# Altium project 48FE+2GE+2SFP.PrjPcb (part 9 of 9)
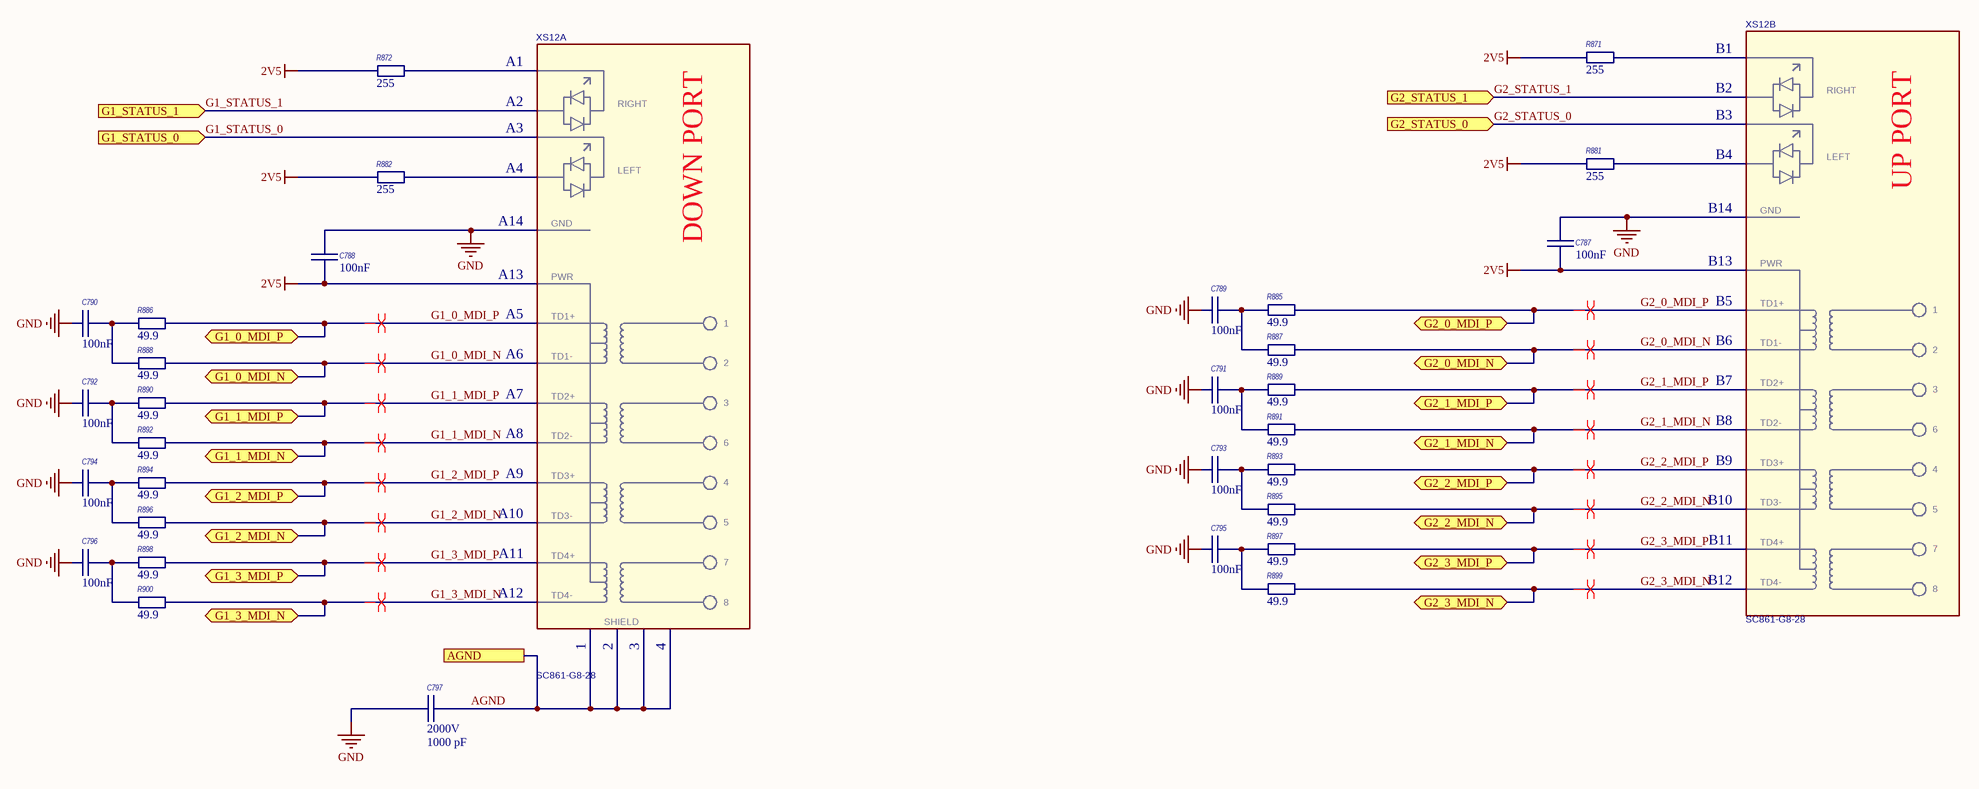
[diagram p26: 44_GE_PORT_1-2.SchDoc]

## Nets that join several sheets
1V: 1_PWR_1 (7 pins), 30_PP0_PWR (59 pins), 40_PP1_PWR (55 pins)
2V5: 11_PHY_FE_17-24 (19 pins), 13_PHY_FE_33-40 (19 pins), 14_PHY_FE_41-48 (19 pins), 15_FE_PORT_1-8 (L34.1), 16_FE_PORT_9-16 (L43.1), 17_FE_PORT_17-24 (L44.1), 22_PHY_GE_PP1 (11 pins), 30_PP0_PWR (14 pins), 33_PP0_CONFIG (5 pins), 40_PP1_PWR (12 pins), 44_GE_PORT_1-2 (8 pins)
3V3: 5_CLOCK GENERATOR (7 pins), 7_PP0_PHY_CPU_88E1116 (TP98.1), 22_PHY_GE_PP1 (XP13.10), 23_SFP_PORTS (21 pins), 27_PP0_GPP, SPI (13 pins), 28_PP0_SGMII, LED, TWSI (R700.1 R701.1), 30_PP0_PWR (20 pins), 32_PP0_NC (R702.1), 33_PP0_CONFIG (6 pins), 34_PP1_JTAG, PCIe (R749.2 R751.2 R753.2 R760.1), 40_PP1_PWR (22 pins), 42_PP1_NC (R831.1)
GND: 1_PWR_1 (25 pins), 5_CLOCK GENERATOR (14 pins), 6_LED INTERFACE SFP (LED1.6 LED1.8), 7_PP0_PHY_CPU_88E1116 (TP97.1), 11_PHY_FE_17-24 (41 pins), 13_PHY_FE_33-40 (40 pins), 14_PHY_FE_41-48 (41 pins), 15_FE_PORT_1-8 (33 pins), 16_FE_PORT_9-16 (33 pins), 17_FE_PORT_17-24 (33 pins), 22_PHY_GE_PP1 (24 pins), 23_SFP_PORTS (28 pins), 27_PP0_GPP, SPI (7 pins), 28_PP0_SGMII, LED, TWSI (R691.2 R692.2 R693.2), 30_PP0_PWR (58 pins), 33_PP0_CONFIG (22 pins), 34_PP1_JTAG, PCIe (R750.2 R754.2 R755.2), 40_PP1_PWR (59 pins), 41_PP1_GND (221 pins), 44_GE_PORT_1-2 (13 pins)
~{SFP2_ON}: 23_SFP_PORTS (DD37.1 R95.1), 34_PP1_JTAG, PCIe (DD48.H23)
AGND: 15_FE_PORT_1-8 (XS3.113 XS3.115 XS3.119 XS3.121), 16_FE_PORT_9-16 (XS4.113 XS4.115 XS4.119 XS4.121), 17_FE_PORT_17-24 (XS5.113 XS5.115 XS5.119 XS5.121), 23_SFP_PORTS (9 pins), 44_GE_PORT_1-2 (5 pins)
EN_I2C_SW: 23_SFP_PORTS (DD6.6 R103.2), 27_PP0_GPP, SPI (DD39.H04 TP24.1)
G2_0_MDI_N: 22_PHY_GE_PP1 (DD36.19), 44_GE_PORT_1-2 (R887.2 XS12.B6)
G2_0_MDI_P: 22_PHY_GE_PP1 (DD36.18), 44_GE_PORT_1-2 (R885.2 XS12.B5)
G2_1_MDI_N: 22_PHY_GE_PP1 (DD36.22), 44_GE_PORT_1-2 (R891.2 XS12.B8)
G2_1_MDI_P: 22_PHY_GE_PP1 (DD36.21), 44_GE_PORT_1-2 (R889.2 XS12.B7)
G2_2_MDI_N: 22_PHY_GE_PP1 (DD36.28), 44_GE_PORT_1-2 (R895.2 XS12.B10)
G2_2_MDI_P: 22_PHY_GE_PP1 (DD36.27), 44_GE_PORT_1-2 (R893.2 XS12.B9)
G2_3_MDI_N: 22_PHY_GE_PP1 (DD36.31), 44_GE_PORT_1-2 (R899.2 XS12.B12)
G2_3_MDI_P: 22_PHY_GE_PP1 (DD36.30), 44_GE_PORT_1-2 (R897.2 XS12.B11)
G2_CONFIG_0: 22_PHY_GE_PP1 (DD36.40 DD36.46 DD36.48), 44_GE_PORT_1-2 (XS12.B3)
G2_CONFIG_2: 22_PHY_GE_PP1 (DD36.38 DD36.45), 44_GE_PORT_1-2 (XS12.B2)
P0_LEDDATA1: 6_LED INTERFACE SFP (R51.2), 28_PP0_SGMII, LED, TWSI (DD39.AC03), 33_PP0_CONFIG (R745.1)
PP0_CPU_I2C_SCL: 23_SFP_PORTS (DD6.3), 28_PP0_SGMII, LED, TWSI (DD39.M25)
PP0_CPU_I2C_SDA: 23_SFP_PORTS (DD6.13), 28_PP0_SGMII, LED, TWSI (DD39.M26)
PP0_GPIO25: 6_LED INTERFACE SFP (LED1.3), 27_PP0_GPP, SPI (DD39.H01 TP42.1)
PP0_RGMII_MDC: 7_PP0_PHY_CPU_88E1116 (TP45.1), 33_PP0_CONFIG (R723.1)
PP0_RGMII_TX_0: 7_PP0_PHY_CPU_88E1116 (TP91.1), 33_PP0_CONFIG (R731.1)
PP0_RGMII_TX_1: 7_PP0_PHY_CPU_88E1116 (TP92.1), 33_PP0_CONFIG (R732.1)
PP0_RGMII_TX_2: 7_PP0_PHY_CPU_88E1116 (TP94.1), 33_PP0_CONFIG (R734.1)
PP0_RGMII_TX_3: 7_PP0_PHY_CPU_88E1116 (TP95.1), 33_PP0_CONFIG (R744.1)
PP0_RGMII_TX_CLK: 7_PP0_PHY_CPU_88E1116 (TP93.1), 33_PP0_CONFIG (R730.1)
PP0_SPI_MISO: 27_PP0_GPP, SPI (5 pins), 33_PP0_CONFIG (R746.1)
PP0_SPI_MOSI: 27_PP0_GPP, SPI (5 pins), 33_PP0_CONFIG (R726.1)
PP0_SPI_SCK: 27_PP0_GPP, SPI (5 pins), 33_PP0_CONFIG (R728.1)
PP1_88E1112_CLK: 5_CLOCK GENERATOR (R91.1), 22_PHY_GE_PP1 (DD36.36 R914.2)
SFP1_RX_N: 23_SFP_PORTS (C567.2), 28_PP0_SGMII, LED, TWSI (DD39.M01)
SFP1_RX_P: 23_SFP_PORTS (C569.2), 28_PP0_SGMII, LED, TWSI (DD39.M02)
SFP1_TX_N: 23_SFP_PORTS (XS9.L19), 28_PP0_SGMII, LED, TWSI (C596.2)
SFP1_TX_P: 23_SFP_PORTS (XS9.L18), 28_PP0_SGMII, LED, TWSI (C594.2)
SFP2_SDET: 23_SFP_PORTS (R616.1 R690.2), 34_PP1_JTAG, PCIe (DD48.G23)
SW_SFP0/SFP1: 23_SFP_PORTS (DD6.10), 27_PP0_GPP, SPI (DD39.J02 TP27.1)
U1_SSMII_TXD_0: 26_PP0_SSMII (DD39.AB08), 33_PP0_CONFIG (R712.1)
U1_SSMII_TXD_1: 26_PP0_SSMII (DD39.AF07), 33_PP0_CONFIG (R713.1)
U1_SSMII_TXD_2: 26_PP0_SSMII (DD39.AD10), 33_PP0_CONFIG (R719.1)
U1_SSMII_TXD_3: 26_PP0_SSMII (DD39.AC10), 33_PP0_CONFIG (R720.1)
U1_SSMII_TXD_4: 26_PP0_SSMII (DD39.AC11), 33_PP0_CONFIG (R721.1)
U1_SSMII_TXD_5: 26_PP0_SSMII (DD39.AD11), 33_PP0_CONFIG (R724.1)
U1_SSMII_TXD_7: 26_PP0_SSMII (DD39.AB12), 33_PP0_CONFIG (R729.1)
U2_SSMII_TXD_5: 26_PP0_SSMII (DD39.AE15), 33_PP0_CONFIG (R727.1)
U2_SSMII_TXD_6: 26_PP0_SSMII (DD39.AD16), 33_PP0_CONFIG (R722.1)
U3_CONFIG_8: 11_PHY_FE_17-24 (DD31.96 DD31.111 DD31.112), 17_FE_PORT_17-24 (XS5.B15)
U3_INT_PHY: 11_PHY_FE_17-24 (DD31.105 R308.2), 27_PP0_GPP, SPI (TP41.1)
U3_P0_LED0: 11_PHY_FE_17-24 (DD31.61), 17_FE_PORT_17-24 (XS5.A3)
U3_P0_LED2: 11_PHY_FE_17-24 (DD31.59), 17_FE_PORT_17-24 (XS5.A1)
U3_P0_RX_N: 11_PHY_FE_17-24 (DD31.128), 17_FE_PORT_17-24 (R383.2 XS5.A10)
U3_P0_RX_P: 11_PHY_FE_17-24 (DD31.127), 17_FE_PORT_17-24 (R379.2 XS5.A8)
U3_P0_TX_N: 11_PHY_FE_17-24 (DD31.3), 17_FE_PORT_17-24 (R375.2 XS5.A7)
U3_P0_TX_P: 11_PHY_FE_17-24 (DD31.2), 17_FE_PORT_17-24 (R371.2 XS5.A5)
U3_P1_LED0: 11_PHY_FE_17-24 (DD31.98), 17_FE_PORT_17-24 (XS5.B17)
U3_P1_RX_N: 11_PHY_FE_17-24 (DD31.7), 17_FE_PORT_17-24 (R407.2 XS5.B24)
U3_P1_RX_P: 11_PHY_FE_17-24 (DD31.8), 17_FE_PORT_17-24 (R403.2 XS5.B22)
U3_P1_TX_N: 11_PHY_FE_17-24 (DD31.4), 17_FE_PORT_17-24 (R399.2 XS5.B21)
U3_P1_TX_P: 11_PHY_FE_17-24 (DD31.5), 17_FE_PORT_17-24 (R395.2 XS5.B19)
U3_P2_LED0: 11_PHY_FE_17-24 (DD31.94), 17_FE_PORT_17-24 (XS5.C31)
U3_P2_LED2: 11_PHY_FE_17-24 (DD31.92), 17_FE_PORT_17-24 (XS5.C29)
U3_P2_RX_N: 11_PHY_FE_17-24 (DD31.11), 17_FE_PORT_17-24 (R384.2 XS5.C38)
U3_P2_RX_P: 11_PHY_FE_17-24 (DD31.10), 17_FE_PORT_17-24 (R380.2 XS5.C36)
U3_P2_TX_N: 11_PHY_FE_17-24 (DD31.14), 17_FE_PORT_17-24 (R376.2 XS5.C35)
U3_P2_TX_P: 11_PHY_FE_17-24 (DD31.13), 17_FE_PORT_17-24 (R372.2 XS5.C33)
U3_P3_LED0: 11_PHY_FE_17-24 (DD31.56), 17_FE_PORT_17-24 (XS5.D45)
U3_P3_LED2: 11_PHY_FE_17-24 (DD31.54), 17_FE_PORT_17-24 (XS5.D43)
U3_P3_RX_N: 11_PHY_FE_17-24 (DD31.18), 17_FE_PORT_17-24 (R410.2 XS5.D52)
U3_P3_RX_P: 11_PHY_FE_17-24 (DD31.19), 17_FE_PORT_17-24 (R406.2 XS5.D50)
U3_P3_TX_N: 11_PHY_FE_17-24 (DD31.15), 17_FE_PORT_17-24 (R402.2 XS5.D49)
U3_P3_TX_P: 11_PHY_FE_17-24 (DD31.16), 17_FE_PORT_17-24 (R398.2 XS5.D47)
U3_P4_LED0: 11_PHY_FE_17-24 (DD31.53), 17_FE_PORT_17-24 (XS5.E59)
U3_P4_LED2: 11_PHY_FE_17-24 (DD31.51), 17_FE_PORT_17-24 (XS5.E57)
U3_P4_RX_N: 11_PHY_FE_17-24 (DD31.22), 17_FE_PORT_17-24 (R385.2 XS5.E66)
U3_P4_RX_P: 11_PHY_FE_17-24 (DD31.21), 17_FE_PORT_17-24 (R381.2 XS5.E64)
U3_P4_TX_N: 11_PHY_FE_17-24 (DD31.25), 17_FE_PORT_17-24 (R377.2 XS5.E63)
U3_P4_TX_P: 11_PHY_FE_17-24 (DD31.24), 17_FE_PORT_17-24 (R373.2 XS5.E61)
U3_P5_LED0: 11_PHY_FE_17-24 (DD31.50), 17_FE_PORT_17-24 (XS5.F73)
U3_P5_LED2: 11_PHY_FE_17-24 (DD31.47), 17_FE_PORT_17-24 (XS5.F71)
U3_P5_RX_N: 11_PHY_FE_17-24 (DD31.29), 17_FE_PORT_17-24 (R408.2 XS5.F80)
U3_P5_RX_P: 11_PHY_FE_17-24 (DD31.30), 17_FE_PORT_17-24 (R404.2 XS5.F78)
U3_P5_TX_N: 11_PHY_FE_17-24 (DD31.26), 17_FE_PORT_17-24 (R400.2 XS5.F77)
U3_P5_TX_P: 11_PHY_FE_17-24 (DD31.27), 17_FE_PORT_17-24 (R396.2 XS5.F75)
U3_P6_LED0: 11_PHY_FE_17-24 (DD31.68), 17_FE_PORT_17-24 (XS5.G87)
U3_P6_LED2: 11_PHY_FE_17-24 (DD31.66), 17_FE_PORT_17-24 (XS5.G85)
U3_P6_RX_N: 11_PHY_FE_17-24 (DD31.33), 17_FE_PORT_17-24 (R386.2 XS5.G94)
U3_P6_RX_P: 11_PHY_FE_17-24 (DD31.32), 17_FE_PORT_17-24 (R382.2 XS5.G92)
U3_P6_TX_N: 11_PHY_FE_17-24 (DD31.36), 17_FE_PORT_17-24 (R378.2 XS5.G91)
U3_P6_TX_P: 11_PHY_FE_17-24 (DD31.35), 17_FE_PORT_17-24 (R374.2 XS5.G89)
U3_P7_LED0: 11_PHY_FE_17-24 (DD31.46), 17_FE_PORT_17-24 (XS5.H101)
U3_P7_LED2: 11_PHY_FE_17-24 (DD31.44), 17_FE_PORT_17-24 (XS5.H99)
U3_P7_RX_N: 11_PHY_FE_17-24 (DD31.40), 17_FE_PORT_17-24 (R409.2 XS5.H108)
U3_P7_RX_P: 11_PHY_FE_17-24 (DD31.41), 17_FE_PORT_17-24 (R405.2 XS5.H106)
U3_P7_TX_N: 11_PHY_FE_17-24 (DD31.37), 17_FE_PORT_17-24 (R401.2 XS5.H105)
U3_P7_TX_P: 11_PHY_FE_17-24 (DD31.38), 17_FE_PORT_17-24 (R397.2 XS5.H103)
U3_SSMII_RX_SY: 11_PHY_FE_17-24 (DD31.86), 26_PP0_SSMII (DD39.AC17)
U3_SSMII_RXCLK: 11_PHY_FE_17-24 (R307.2), 26_PP0_SSMII (DD39.Y17)
U3_SSMII_RXD_0: 11_PHY_FE_17-24 (DD31.85), 26_PP0_SSMII (DD39.AF18)
U3_SSMII_RXD_1: 11_PHY_FE_17-24 (DD31.84), 26_PP0_SSMII (DD39.AD19)
U3_SSMII_RXD_2: 11_PHY_FE_17-24 (DD31.79), 26_PP0_SSMII (DD39.AE19)
U3_SSMII_RXD_3: 11_PHY_FE_17-24 (DD31.78), 26_PP0_SSMII (DD39.AF20)
U3_SSMII_RXD_4: 11_PHY_FE_17-24 (DD31.77), 26_PP0_SSMII (DD39.AD20)
U3_SSMII_RXD_5: 11_PHY_FE_17-24 (DD31.76), 26_PP0_SSMII (DD39.AC19)
U3_SSMII_RXD_6: 11_PHY_FE_17-24 (DD31.71), 26_PP0_SSMII (DD39.AF21)
U3_SSMII_RXD_7: 11_PHY_FE_17-24 (DD31.70), 26_PP0_SSMII (DD39.AE21)
U3_SSMII_TX_SY: 11_PHY_FE_17-24 (DD31.90), 26_PP0_SSMII (DD39.AE17)
U3_SSMII_TXCLK: 11_PHY_FE_17-24 (DD31.83), 26_PP0_SSMII (R625.1)
U3_SSMII_TXD_0: 11_PHY_FE_17-24 (DD31.89), 26_PP0_SSMII (DD39.AF17), 33_PP0_CONFIG (R733.1)
U3_SSMII_TXD_1: 11_PHY_FE_17-24 (DD31.88), 26_PP0_SSMII (DD39.AE18), 33_PP0_CONFIG (R739.1)
U3_SSMII_TXD_2: 11_PHY_FE_17-24 (DD31.82), 26_PP0_SSMII (DD39.AC18), 33_PP0_CONFIG (R742.1)
U3_SSMII_TXD_3: 11_PHY_FE_17-24 (DD31.81), 26_PP0_SSMII (DD39.AB19), 33_PP0_CONFIG (R747.1)
U3_SSMII_TXD_4: 11_PHY_FE_17-24 (DD31.80), 26_PP0_SSMII (DD39.AF19), 33_PP0_CONFIG (R714.1)
U3_SSMII_TXD_5: 11_PHY_FE_17-24 (DD31.74), 26_PP0_SSMII (DD39.AC20), 33_PP0_CONFIG (R717.1)
U3_SSMII_TXD_6: 11_PHY_FE_17-24 (DD31.73), 26_PP0_SSMII (DD39.AB20), 33_PP0_CONFIG (R725.1)
U3_SSMII_TXD_7: 11_PHY_FE_17-24 (DD31.72), 26_PP0_SSMII (DD39.AE20)